# Altium schematic sheet BLDC_ext.SchDoc
size Letter
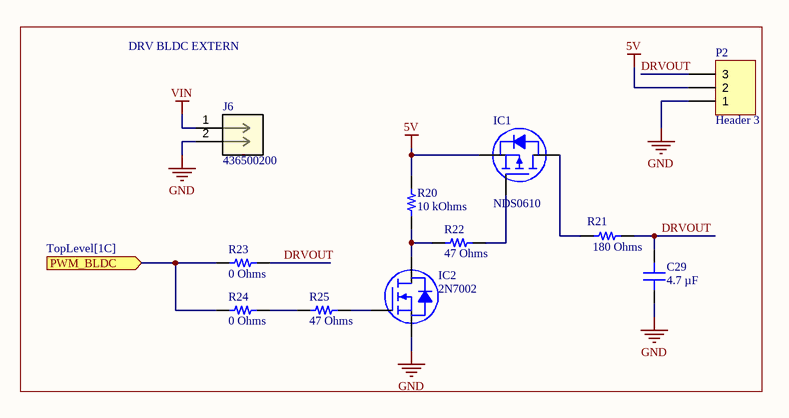
[diagram p0: BLDC_ext.SchDoc]

## Parts
C29  4.7 µF  [CAP 0805_2012]
IC1  NDS0610  [ON SEMI SOT-23-3]
IC2  2N7002  [ON SEMI SOT-23-3]
J6  436500200  [CONN_SD-43650-001_02_MOL]
P2  Header 3  [HDR1X3]
R20  10 kOhms  [YAGEO RES 0603_1608]
R21  180 Ohms  [YAGEO RES 0603_1608]
R22  47 Ohms  [YAGEO RES 0603_1608]
R23  0 Ohms  [YAGEO RES 0603_1608]
R24  0 Ohms  [YAGEO RES 0603_1608]
R25  47 Ohms  [YAGEO RES 0603_1608]

## Blocks framed on the sheet
DRV BLDC EXTERN: C29 IC1 IC2 J6 P2 R20-R25

## Ports
PWM_BLDC (in, see TopLevel[1C])

## Nets
5V: IC1.2(S) P2.2 R20.2
GND: C29.1 IC2.2(S) J6.2 P2.1
VIN: J6.1
DRVOUT: C29.2 P2.3 R21.2 R23.2
PWM_BLDC: R23.1 R24.1 ; port PWM_BLDC
NetIC1_1: IC1.1(G) R22.2
NetIC1_3: IC1.3(D) R21.1
NetIC2_1: IC2.1(G) R25.2
NetIC2_3: IC2.3(D) R20.1 R22.1
NetR24_2: R24.2 R25.1

## Notes on the sheet
- DWG. NO.
- REV.
- SHT.
- REVISION
- DESCRIPTION
- DATE
- APPROVED
- THIS DOCUMENT AND THE DATA DISCLOSED HEREIN OR HEREWITH IS THE PROPERTY OF ALTIUM LIMITED AND MAY BE FREELY DISTRIBUTED IN WHOLE. NO RIGHTS ARE RESERVED OR EXPRESS OR IMPLIED WARANTEE GIVEN.
- ENG:
- DSN:
- APPROVALS
- PROJECT
- DOCUMENT REVISION:
- DESIGN ITEM:
- CHK:
- BOM:
- REFERENCE DOCUMENTS
- PROJECT REVISION:
- TITLE
- FAB DWG:
- PCB DWG:
- ASSY DWG:
- SCALE:
- SIZE
- C
- CAGE CODE
- FILE NAME
- DWG NO.
- SHEET
- OF
- REV

## Library data of the parts
C29 = C0805X475J9RACAUTO: CAP CER 4.7UF 6.3V X7R 0805; manufacturer: KEMET; Tolerance: ±5%; Part Number: C0805X475J9RACAUTO; Applications: Automotive, Boardflex Sensitive; componentlink1description: Datasheet; componentlink1url: https://api.kemet.com/component-edge/download/datasheet/C0805X475J9RACAUTO.pdf; componentlink2description: DigiKey Link; componentlink2url: https://www.digikey.com/en/products/detail/kemet/C0805X475J9RACAUTO/7427557; Device Package: 0805 (2012 Metric); Features: Soft Termination; lastupdated: 2024-02-09 20:16:08; Lifecycle Status: Active; Minimum Order: 1; Mounting Type: Surface Mount, MLCC; Operating Temperature: -55°C ~ 125°C; Package / Case: 0805 (2012 Metric); packaging: TapeAndReel; partid: 2889; Part Status: Active; price: 0.20; Ratings: AEC-Q200; series: SMD Auto X7R Flex; Size / Dimension: 0.079" L x 0.049" W (2.00mm x 1.25mm); Supplier 1: DigiKey; Supplier Part Number 1: 399-15727-1-ND; Temperature Coefficient: X7R; Thickness (Max): 0.057" (1.45mm); value: 4.7 µF; Voltage - Rated: 6.3V
IC1 = NDS0610: MOSFET P-CH 60V 120MA SOT-23; Manufacturer: ON Semiconductor; Current - Continuous Drain (Id) @ 25°C: 120mA (Ta); Drive Voltage (Max Rds On,  Min Rds On): 4.5V, 10V; FET Type: P-Channel; Gate Charge (Qg) (Max) @ Vgs: 2.5nC @ 10V; Input Capacitance (Ciss) (Max) @ Vds: 79pF @ 25V; Power Dissipation (Max): 360mW (Ta); Rds On (Max) @ Id, Vgs: 10Ohm @ 500mA, 10V; Vgs (Max): ±20V; Vgs(th) (Max) @ Id: 3.5V @ 1mA; Part Number: NDS0610; ComponentLink1Description: Datasheet; ComponentLink1URL: https://www.onsemi.com/pub/Collateral/NDS0610-D.PDF; ComponentLink2Description: DigiKey Link; ComponentLink2URL: http://digikey.com/product-detail/en/on-semiconductor/NDS0610/NDS0610CT-ND/244299; Drain to Source Voltage (Vdss): 60V; LastUpdated: 2024-06-03 20:15:27; Lifecycle Status: Active; Minimum Order: 1; Mounting Type: Surface Mount; Operating Temperature: -55°C ~ 150°C (TJ); Package / Case: TO-236-3, SC-59, SOT-23-3; Packaging: TapeAndReel; Part Status: Active; Price: 0.06; Series: -; Supplier 1: DigiKey; Supplier Part Number 1: NDS0610CT-ND; Supplier Device Package: SOT-23; Technology: MOSFET (Metal Oxide)
IC2 = 2N7002: MOSFET N-CH 60V 115MA SOT-23; Manufacturer: ON Semiconductor; Current - Continuous Drain (Id) @ 25°C: 115mA (Ta); Drive Voltage (Max Rds On,  Min Rds On): 5V, 10V; FET Type: N-Channel; Input Capacitance (Ciss) (Max) @ Vds: 50pF @ 25V; Power Dissipation (Max): 200mW (Ta); Rds On (Max) @ Id, Vgs: 7.5Ohm @ 500mA, 10V; Vgs (Max): ±20V; Vgs(th) (Max) @ Id: 2.5V @ 250µA; Part Number: 2N7002; ComponentLink1Description: Datasheet; ComponentLink1URL: https://www.onsemi.com/pub/Collateral/NDS7002A-D.PDF; ComponentLink2Description: DigiKey Link; ComponentLink2URL: http://digikey.com/product-detail/en/on-semiconductor/2N7002/2N7002NCT-ND/244664; Drain to Source Voltage (Vdss): 60V; LastUpdated: 2024-06-03 20:15:26; Lifecycle Status: Active; Minimum Order: 1; Mounting Type: Surface Mount; Operating Temperature: -55°C ~ 150°C (TJ); Package / Case: TO-236-3, SC-59, SOT-23-3; Packaging: TapeAndReel; Part Status: Active; Price: 0.06; Series: -; Supplier 1: DigiKey; Supplier Part Number 1: 2N7002NCT-ND; Supplier Device Package: SOT-23 (TO-236AB); Technology: MOSFET (Metal Oxide)
J6 = 436500200: No Description Available; Mfr_Name: Molex Connector Corporation; RefDes: RefDes; Type: Type
P2 = Header 3: Header, 3-Pin; LatestRevisionDate: 17-Jul-2002; LatestRevisionNote: Re-released for DXP Platform.; Publisher: Altium Limited
R20 = RT0603DRD0710KL: RES SMD 10K OHM 0.5% 1/10W 0603; Manufacturer: Yageo; Power (Watts): 0.1W, 1/10W; Temperature Coefficient: ±25ppm/°C; Part Number: RT0603DRD0710KL; Value: 10 kOhms; ComponentLink1Description: Datasheet; ComponentLink1URL: https://www.yageo.com/upload/media/product/productsearch/datasheet/rchip/PYu-RT_1-to-0.01_RoHS_L_11.pdf; ComponentLink2Description: DigiKey Link; ComponentLink2URL: https://www.digikey.com/en/products/detail/yageo/RT0603DRD0710KL/1035416; Composition: Thin Film; Device Package: 0603 (1608 Metric); Height - Seated (Max): 0.022" (0.55mm); LastUpdated: 2024-07-25 09:19:32; Lifecycle Status: Active; Minimum Order: 1; Number of Terminations: 2; Operating Temperature: -55°C ~ 155°C; Package / Case: 0603 (1608 Metric); Packaging: TapeAndReel; PartId: 5487; Part Status: Active; Price: 0.02; Resistance: 10 kOhms; Series: RT; Size / Dimension: 0.063" L x 0.031" W (1.60mm x 0.80mm); Supplier 1: DigiKey; Supplier Part Number 1: 311-10KDCT-ND; Supplier Device Package: 0603; Tolerance: ±0.5%
R21 = RT0603BRD07180RL: RES SMD 180 OHM 0.1% 1/10W 0603; Manufacturer: Yageo; Power (Watts): 0.1W, 1/10W; Temperature Coefficient: ±25ppm/°C; Part Number: RT0603BRD07180RL; Value: 180 Ohms; ComponentLink1Description: Datasheet; ComponentLink1URL: https://www.yageo.com/upload/media/product/productsearch/datasheet/rchip/PYu-RT_1-to-0.01_RoHS_L_11.pdf; ComponentLink2Description: DigiKey Link; ComponentLink2URL: https://www.digikey.com/en/products/detail/yageo/RT0603BRD07180RL/1072294; Composition: Thin Film; Device Package: 0603 (1608 Metric); Height - Seated (Max): 0.022" (0.55mm); LastUpdated: 2024-07-25 09:19:32; Lifecycle Status: Active; Minimum Order: 1; Number of Terminations: 2; Operating Temperature: -55°C ~ 155°C; Package / Case: 0603 (1608 Metric); Packaging: TapeAndReel; PartId: 6294; Part Status: Active; Price: 0.03; Resistance: 180 Ohms; Series: RT; Size / Dimension: 0.063" L x 0.031" W (1.60mm x 0.80mm); Supplier 1: DigiKey; Supplier Part Number 1: YAG1549CT-ND; Supplier Device Package: 0603; Tolerance: ±0.1%
R22 R25 = SR0603JR-7T47RL: RES 47 OHM 5% 1/4W 0603; Manufacturer: Yageo; Power (Watts): 0.25W, 1/4W; Temperature Coefficient: ±100ppm/°C; Part Number: SR0603JR-7T47RL; Value: 47 Ohms; ComponentLink1Description: Datasheet; ComponentLink1URL: http://www.yageo.com/NewPortal/_en/search/productDocs.jsp?YageoPartNumber=SR0603JR-7T47RL; ComponentLink2Description: DigiKey Link; ComponentLink2URL: https://www.digikey.com/en/products/detail/yageo/SR0603JR-7T47RL/9696400; Composition: Thick Film; Device Package: 0603 (1608 Metric); Features: Automotive AEC-Q200, Pulse Withstanding; Height - Seated (Max): 0.022" (0.55mm); LastUpdated: 2024-07-25 09:19:30; Lifecycle Status: Active; Minimum Order: 1; Number of Terminations: 2; Operating Temperature: -55°C ~ 155°C; Package / Case: 0603 (1608 Metric); Packaging: TapeAndReel; PartId: 8875; Part Status: Active; Price: 0.03; Ratings: AEC-Q200; Resistance: 47 Ohms; Series: SR; Size / Dimension: 0.063" L x 0.031" W (1.60mm x 0.80mm); Supplier 1: DigiKey; Supplier Part Number 1: YAG6162CT-ND; Supplier Device Package: 0603; Tolerance: ±5%
R23 R24 = PA0603-R-070RL: RES 0 OHM JUMPER 1/2W 0603; Manufacturer: Yageo; Power (Watts): 0.1W, 1/10W; Temperature Coefficient: ±150ppm/°C; Part Number: PA0603-R-070RL; Value: 0 Ohms; ComponentLink1Description: Datasheet; ComponentLink1URL: http://www.yageo.com/NewPortal/_en/search/productDocs.jsp?YageoPartNumber=PA0603-R-070RL; ComponentLink2Description: DigiKey Link; ComponentLink2URL: https://www.digikey.com/en/products/detail/yageo/PA0603-R-070RL/8255972; Composition: Metal Element; Device Package: 0603 (1608 Metric); Features: Automotive AEC-Q200, Current Sense; Height - Seated (Max): 0.024" (0.60mm); LastUpdated: 2024-07-25 09:19:32; Lifecycle Status: Active; Minimum Order: 1; Number of Terminations: 2; Operating Temperature: -55°C ~ 155°C; Package / Case: 0603 (1608 Metric); Packaging: TapeAndReel; PartId: 4862; Part Status: Active; Price: 0.08; Resistance: 0 Ohms; Series: PA; Size / Dimension: 0.063" L x 0.031" W (1.60mm x 0.80mm); Supplier 1: DigiKey; Supplier Part Number 1: YAG5757CT-ND; Supplier Device Package: 0603; Tolerance: Jumper